# EAGLE schematic EBot4_v_12 (EAGLE 7.7.0)

## Sheet 1 of 4
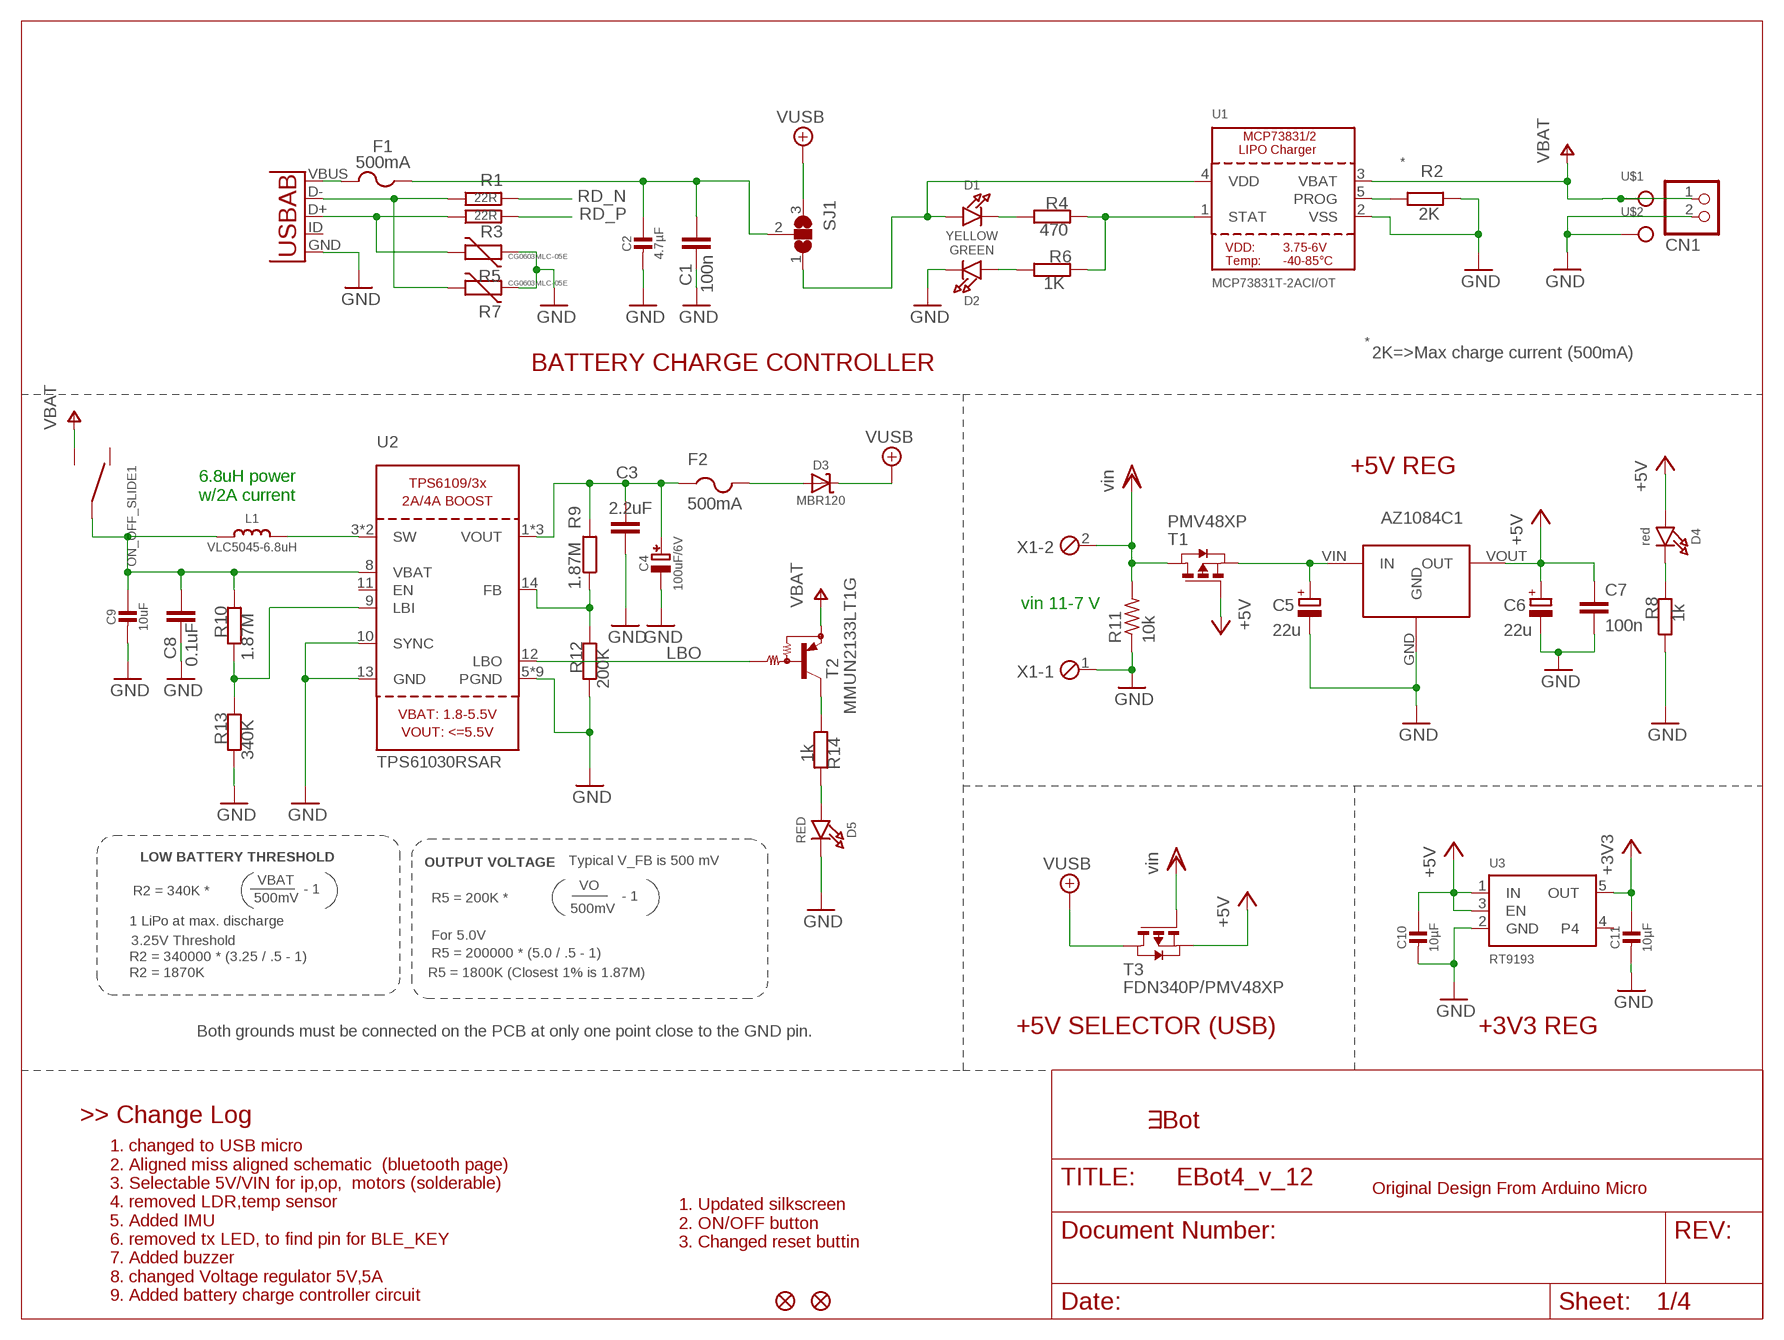
[diagram p0: schematic, sheet 1]

### Parts
AZ1084C1  AZ1084C  [AZ1084C]
C1  100n  C-EUC0402  [C0402]
C2  4.7µF  CAP_CERAMIC0805-NOOUTLINE  [0805-NO]
C3  2.2uF  C-EUC0402  [C0402]
C4  100uF/6V  CAP_TANTALUMB/3528_REFLOW  [EIA3528-21/B-R]
C5  22u  CPOL-EUSMCB  [SMC_B]
C6  22u  CPOL-EUSMCB  [SMC_B]
C7  100n  C-EUC0402  [C0402]
C8  0.1uF  C-EUC0402  [C0402]
C9  10uF  CAP_CERAMIC0805-NOOUTLINE  [0805-NO]
C10  10µF  CAP_CERAMIC_0805  [_0805]
C11  10µF  CAP_CERAMIC_0805  [_0805]
CN1  JST_2PIN-SMT  [JST-PH-2-SMT]
D1  YELLOW  LED0805_NOOUTLINE  [CHIPLED_0805_NOOUTLINE]
D2  GREEN  LED0805_NOOUTLINE  [CHIPLED_0805_NOOUTLINE]
D3  MBR120  DIODE-SCHOTTKYSOD-123  [SOD-123]
D4  red  LED0805_NOOUTLINE  [CHIPLED_0805_NOOUTLINE]
D5  RED  LED0805_NOOUTLINE  [CHIPLED_0805_NOOUTLINE]
EBOT_LOGO2  EBOT_NAME_6MM  [EBOT_NAME_6MM]
F1  500mA  PTCFUSE-1206  [R1206]
F2  500mA  PTCFUSE-1206  [R1206]
JP2  FIDUCIAL1X2  [FIDUCIAL-1X2]
JP3  FIDUCIAL1X2  [FIDUCIAL-1X2]
L1  VLC5045-6.8uH  INDUCTORTDK_VLC5045  [INDUCTOR_5X5MM_TDK_VLC5045]
ON_OFF_SLIDE1  OS102011MA1QN1  [OS102011MA1QN1]
R1  22R  R-EU_R0402  [R0402]
R2  2K  R-EU_R0402  [R0402]
R3  22R  R-EU_R0402  [R0402]
R4  470  R-EU_R0402  [R0402]
R5  CG0603MLC-05E  VARISTORCN0603  [CT/CN0603]
R6  1K  R-EU_R0402  [R0402]
R7  CG0603MLC-05E  VARISTORCN0603  [CT/CN0603]
R8  1k  R-EU_R0402  [R0402]
R9  1.87M  R-EU_R0402  [R0402]
R10  1.87M  R-EU_R0402  [R0402]
R11  10k  R-US_R0805  [R0805]
R12  200K  R-EU_R0402  [R0402]
R13  340K  R-EU_R0402  [R0402]
R14  1k  R-EU_R0402  [R0402]
SJ1  SJ2W  [SJ_2]
T1  PMV48XP  PMOSSOT23  [SOT-23]
T2  MMUN2133LT1G  MUN2114T1-PNP_DRIVER-SC59-BEC  [SC59-BEC]
T3  FDN340P/PMV48XP  PMOSSOT23  [SOT-23]
U1  MCP73831T-2ACI/OT  MCP73831/2  [SOT23-5]
U2  TPS61030RSAR  VREG_TPS6103X  [PVQFN-16]
U3  RT9193  VREG_SOT23-5  [SOT23-5@1]
U4  USB-AB  [USB-AB-MICRO-SMD]
U$1  BATCON  [BATCON]
U$2  BATCON  [BATCON]
X1  MPT2  [2POL254]

### Nets
+3V3: C11.1 U3.5(OUT) ; also sheet 3,4
+5V: AZ1084C1.VOUT(OUT) C6.+ C7.1 C10.1 D4.A T1.3(G) T3.2(S) U3.1(IN) U3.3(EN) ; also sheet 2,3,4
D+: R3.1 R5.1 U4.D+
D-: R1.1 R7.1 U4.D-
GND: AZ1084C1.GND C1.2 C2.2 C3.2 C4.- C5.- C6.- C7.2 C8.2 C9.2 C10.2 C11.2 CN1.2 D2.C D5.C R2.2 R5.2 R7.2 R8.1 R11.1 R12.1 R13.1 U1.2(VSS) U2.5(PGND) U2.6(PGND) U2.7(PGND) U2.10(SYNC) U2.13(GND) U2.P$18(PGND) U2.P$19(PGND) U2.P$20(PGND) U2.P$21(PGND) U2.P$22(PGND) U2.THERMAL(PGND) U3.2(GND) U4.GND U$2.P$1 X1.1 ; also sheet 2,3,4
LBI: R10.1 R13.2 U2.9(LBI)
LBO: T2.B U2.12(LBO)
N$1: D1.A SJ1.1 U1.4(VDD)
N$3: C8.1 C9.1 L1.P$1 ON_OFF_SLIDE1.P$2 R10.2 U2.8(VBAT)
N$7: D1.C R4.1
N$15: R4.2 R6.2 U1.1(STAT)
N$16: R2.1 U1.5(PROG)
N$17: D2.A R6.1
N$18: L1.P$2 U2.3(SW) U2.4(SW)
N$19: D4.C R8.2
N$20: D5.A R14.2
N$21: R14.1 T2.C
N$22: D3.A F2.2
N$26: F1.2 U4.VBUS
N$27: C1.1 C2.1 F1.1 SJ1.2
N$28: R9.1 R12.2 U2.14(FB)
N$30: AZ1084C1.VIN(IN) C5.+ T1.2(S)
RD_N: R1.2 ; also sheet 2
RD_P: R3.2 ; also sheet 2
V+: CN1.1 ON_OFF_SLIDE1.P$3 U1.3(VBAT) U$1.P$1 ; supply symbol labelled VBAT
VBAT: T2.E
VDD: R11.2 T1.1(D) T3.3(G) X1.2 ; supply symbol labelled vin ; also sheet 3
VOUT1: C3.1 C4.+ F2.1 R9.2 U2.1(VOUT) U2.15(VOUT) U2.16(VOUT)
VUSB: D3.C SJ1.3 T3.1(D) ; also sheet 2,4
Unconnected: ON_OFF_SLIDE1.P$1 U2.11(EN) U3.4 U4.ID(USBID)

### Notes on the sheet
- *
- *
- 2K=>Max charge current (500mA)
- BATTERY CHARGE CONTROLLER
- +5V REG
- 6.8uH power
  w/2A current
- vin 11-7 V
- LOW BATTERY THRESHOLD | Typical V_FB is 500 mV
- OUTPUT VOLTAGE
- VBAT
- - 1 | VO
- R2 = 340K *
- 500mV | R5 = 200K * | - 1
- 500mV
- 1 LiPo at max. discharge
- For 5.0V
- 3.25V Threshold
- R2 = 340000 * (3.25 / .5 - 1) | R5 = 200000 * (5.0 / .5 - 1)
- R2 = 1870K | R5 = 1800K (Closest 1% is 1.87M)
- Both grounds must be connected on the PCB at only one point close to the GND pin. | +5V SELECTOR (USB) | +3V3 REG
- >> Change Log
- Original Design From Arduino Micro
- 1. Updated silkscreen
  2. ON/OFF button
  3. Changed reset buttin
- 1. changed to USB micro
  2. Aligned miss aligned schematic  (bluetooth page)
  3. Selectable 5V/VIN for ip,op,  motors (solderable)
  4. removed LDR,temp sensor
  5. Added IMU
  6. removed tx LED, to find pin for BLE_KEY
  7. Added buzzer
  8. changed Voltage regulator 5V,5A
  9. Added battery charge controller circuit

## Sheet 2 of 4
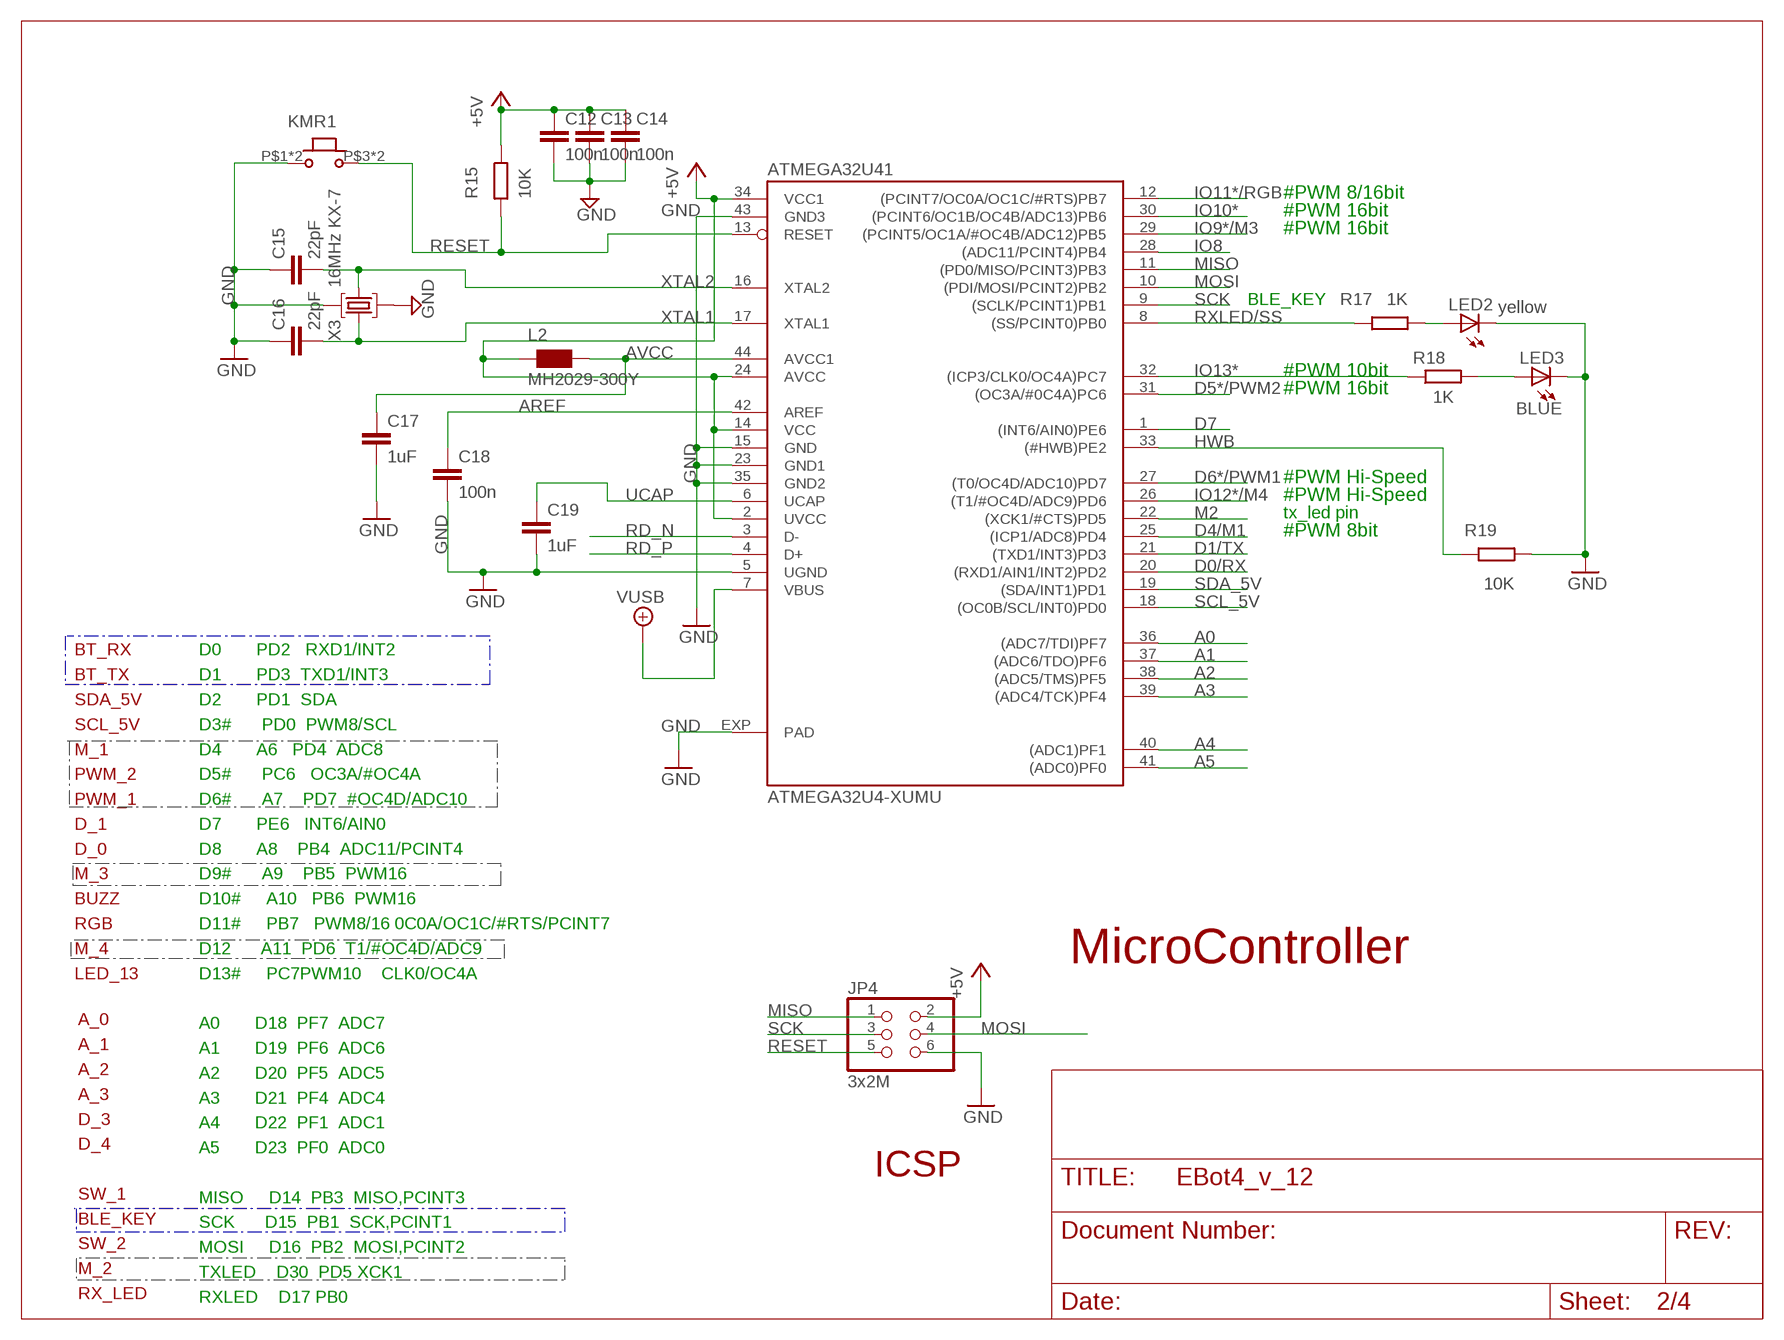
[diagram p1: schematic, sheet 2]

### Parts
ATMEGA32U41  ATMEGA32U4-XUMU  [QFN44ML7X7]
C12  100n  C-EUC0402  [C0402]
C13  100n  C-EUC0402  [C0402]
C14  100n  C-EUC0402  [C0402]
C15  22pF  C-EUC0402  [C0402]
C16  22pF  C-EUC0402  [C0402]
C17  1uF  C-EUC0402  [C0402]
C18  100n  C-EUC0402  [C0402]
C19  1uF  C-EUC0402  [C0402]
JP4  3x2M  PINHD-2X3  [2X03]
KMR1  KMR7  [KMR7]
L2  MH2029-300Y  WE-CBF_0805  [0805]
LED2  yellow  LEDCHIPLED_0805  [CHIPLED_0805]
LED3  BLUE  LEDCHIPLED_0805  [CHIPLED_0805]
R15  10K  R-EU_R0402  [R0402]
R17  1K  R-EU_R0402  [R0402]
R18  1K  R-EU_R0402  [R0402]
R19  10K  R-EU_R0402  [R0402]
X3  16MHz KX-7  CRYSTAL-3.2-2.5  [CRYSTAL-3.2-2.5]

### Nets
+5V: ATMEGA32U41.2(UVCC) ATMEGA32U41.14(VCC) ATMEGA32U41.24(AVCC) ATMEGA32U41.34(VCC1) C12.1 C13.1 C14.1 JP4.2 L2.1 R15.1 ; also sheet 1,3,4
A0: ATMEGA32U41.36((ADC7/TDI)PF7) ; also sheet 3
A1: ATMEGA32U41.37((ADC6/TDO)PF6) ; also sheet 3
A2: ATMEGA32U41.38((ADC5/TMS)PF5) ; also sheet 3
A3: ATMEGA32U41.39((ADC4/TCK)PF4) ; also sheet 3
A4: ATMEGA32U41.40((ADC1)PF1) ; also sheet 3
A5: ATMEGA32U41.41((ADC0)PF0) ; also sheet 3
AREF: ATMEGA32U41.42(AREF) C18.1
AVCC: ATMEGA32U41.44(AVCC1) C17.1 L2.2
D0/RX: ATMEGA32U41.20((RXD1/AIN1/INT2)PD2) ; also sheet 4
D1/TX: ATMEGA32U41.21((TXD1/INT3)PD3) ; also sheet 4
D4/M1: ATMEGA32U41.25((ICP1/ADC8)PD4) ; also sheet 3
D5*/PWM2: ATMEGA32U41.31((OC3A/#0C4A)PC6) ; also sheet 3
D6*/PWM1: ATMEGA32U41.27((T0/OC4D/ADC10)PD7) ; also sheet 3
D7: ATMEGA32U41.1((INT6/AIN0)PE6) ; also sheet 3
GND: ATMEGA32U41.5(UGND) ATMEGA32U41.15(GND) ATMEGA32U41.23(GND1) ATMEGA32U41.35(GND2) ATMEGA32U41.43(GND3) ATMEGA32U41.EXP(PAD) C12.2 C13.2 C14.2 C15.1 C16.1 C17.2 C18.2 C19.2 JP4.6 KMR1.P$1 KMR1.P$2 LED2.C LED3.C R19.2 X3.2(GND) X3.4(GND) ; also sheet 1,3,4
HWB: ATMEGA32U41.33((#HWB)PE2) R19.1
IO8: ATMEGA32U41.28((ADC11/PCINT4)PB4) ; also sheet 3
IO9*/M3: ATMEGA32U41.29((PCINT5/OC1A/#OC4B/ADC12)PB5) ; also sheet 3
IO10*: ATMEGA32U41.30((PCINT6/OC1B/OC4B/ADC13)PB6) ; also sheet 3
IO11*/RGB: ATMEGA32U41.12((PCINT7/OC0A/OC1C/#RTS)PB7) ; also sheet 3
IO12*/M4: ATMEGA32U41.26((T1/#OC4D/ADC9)PD6) ; also sheet 3
IO13*: ATMEGA32U41.32((ICP3/CLK0/OC4A)PC7) R18.1
M2: ATMEGA32U41.22((XCK1/#CTS)PD5) ; also sheet 3
MISO: ATMEGA32U41.11((PD0/MISO/PCINT3)PB3) JP4.1 ; also sheet 4
MOSI: ATMEGA32U41.10((PDI/MOSI/PCINT2)PB2) JP4.4 ; also sheet 4
N$2: LED2.A R17.2
N$4: LED3.A R18.2
RD_N: ATMEGA32U41.3(D-) ; also sheet 1
RD_P: ATMEGA32U41.4(D+) ; also sheet 1
RESET: ATMEGA32U41.13(RESET) JP4.5 KMR1.P$3 KMR1.P$4 R15.2
RXLED/SS: ATMEGA32U41.8((SS/PCINT0)PB0) R17.1
SCK: ATMEGA32U41.9((SCLK/PCINT1)PB1) JP4.3 ; also sheet 4
SCL_5V: ATMEGA32U41.18((OC0B/SCL/INT0)PD0) ; also sheet 3
SDA_5V: ATMEGA32U41.19((SDA/INT1)PD1) ; also sheet 3
UCAP: ATMEGA32U41.6(UCAP) C19.1
VUSB: ATMEGA32U41.7(VBUS) ; also sheet 1,4
XTAL1: ATMEGA32U41.17(XTAL1) C16.2 X3.3(C2)
XTAL2: ATMEGA32U41.16(XTAL2) C15.2 X3.1(C1)

### Buses
B$1
B$2

### Notes on the sheet
- #PWM 8/16bit
- #PWM 16bit
- #PWM 16bit
- BLE_KEY
- #PWM 10bit
- #PWM 16bit
- #PWM Hi-Speed
- #PWM Hi-Speed
- tx_led pin
- #PWM 8bit
- BT_RX
  BT_TX
  SDA_5V
  SCL_5V
  M_1
  PWM_2
  PWM_1
  D_1
  D_0
  M_3
  BUZZ
  RGB
  M_4
  LED_13
- D0       PD2   RXD1/INT2 
  D1       PD3  TXD1/INT3
  D2       PD1  SDA
  D3#      PD0  PWM8/SCL
  D4       A6   PD4  ADC8
  D5#      PC6   OC3A/#OC4A
  D6#      A7    PD7  #OC4D/ADC10
  D7       PE6   INT6/AIN0
  D8       A8    PB4  ADC11/PCINT4
  D9#      A9    PB5  PWM16
  D10#     A10   PB6  PWM16
  D11#     PB7   PWM8/16 0C0A/OC1C/#RTS/PCINT7
  D12      A11  PD6  T1/#OC4D/ADC9
  D13#     PC7PWM10    CLK0/OC4A 
  
  A0       D18  PF7  ADC7
  A1       D19  PF6  ADC6
  A2       D20  PF5  ADC5
  A3       D21  PF4  ADC4
  A4       D22  PF1  ADC1
  A5       D23  PF0  ADC0
  
  MISO     D14  PB3  MISO,PCINT3
  SCK      D15  PB1  SCK,PCINT1
  MOSI     D16  PB2  MOSI,PCINT2
  TXLED    D30  PD5 XCK1
  RXLED    D17 PB0
- MicroController
- A_0
  A_1
  A_2
  A_3
  D_3
  D_4
   
  SW_1
  BLE_KEY
  SW_2
  M_2
  RX_LED
- ICSP

## Sheet 3 of 4
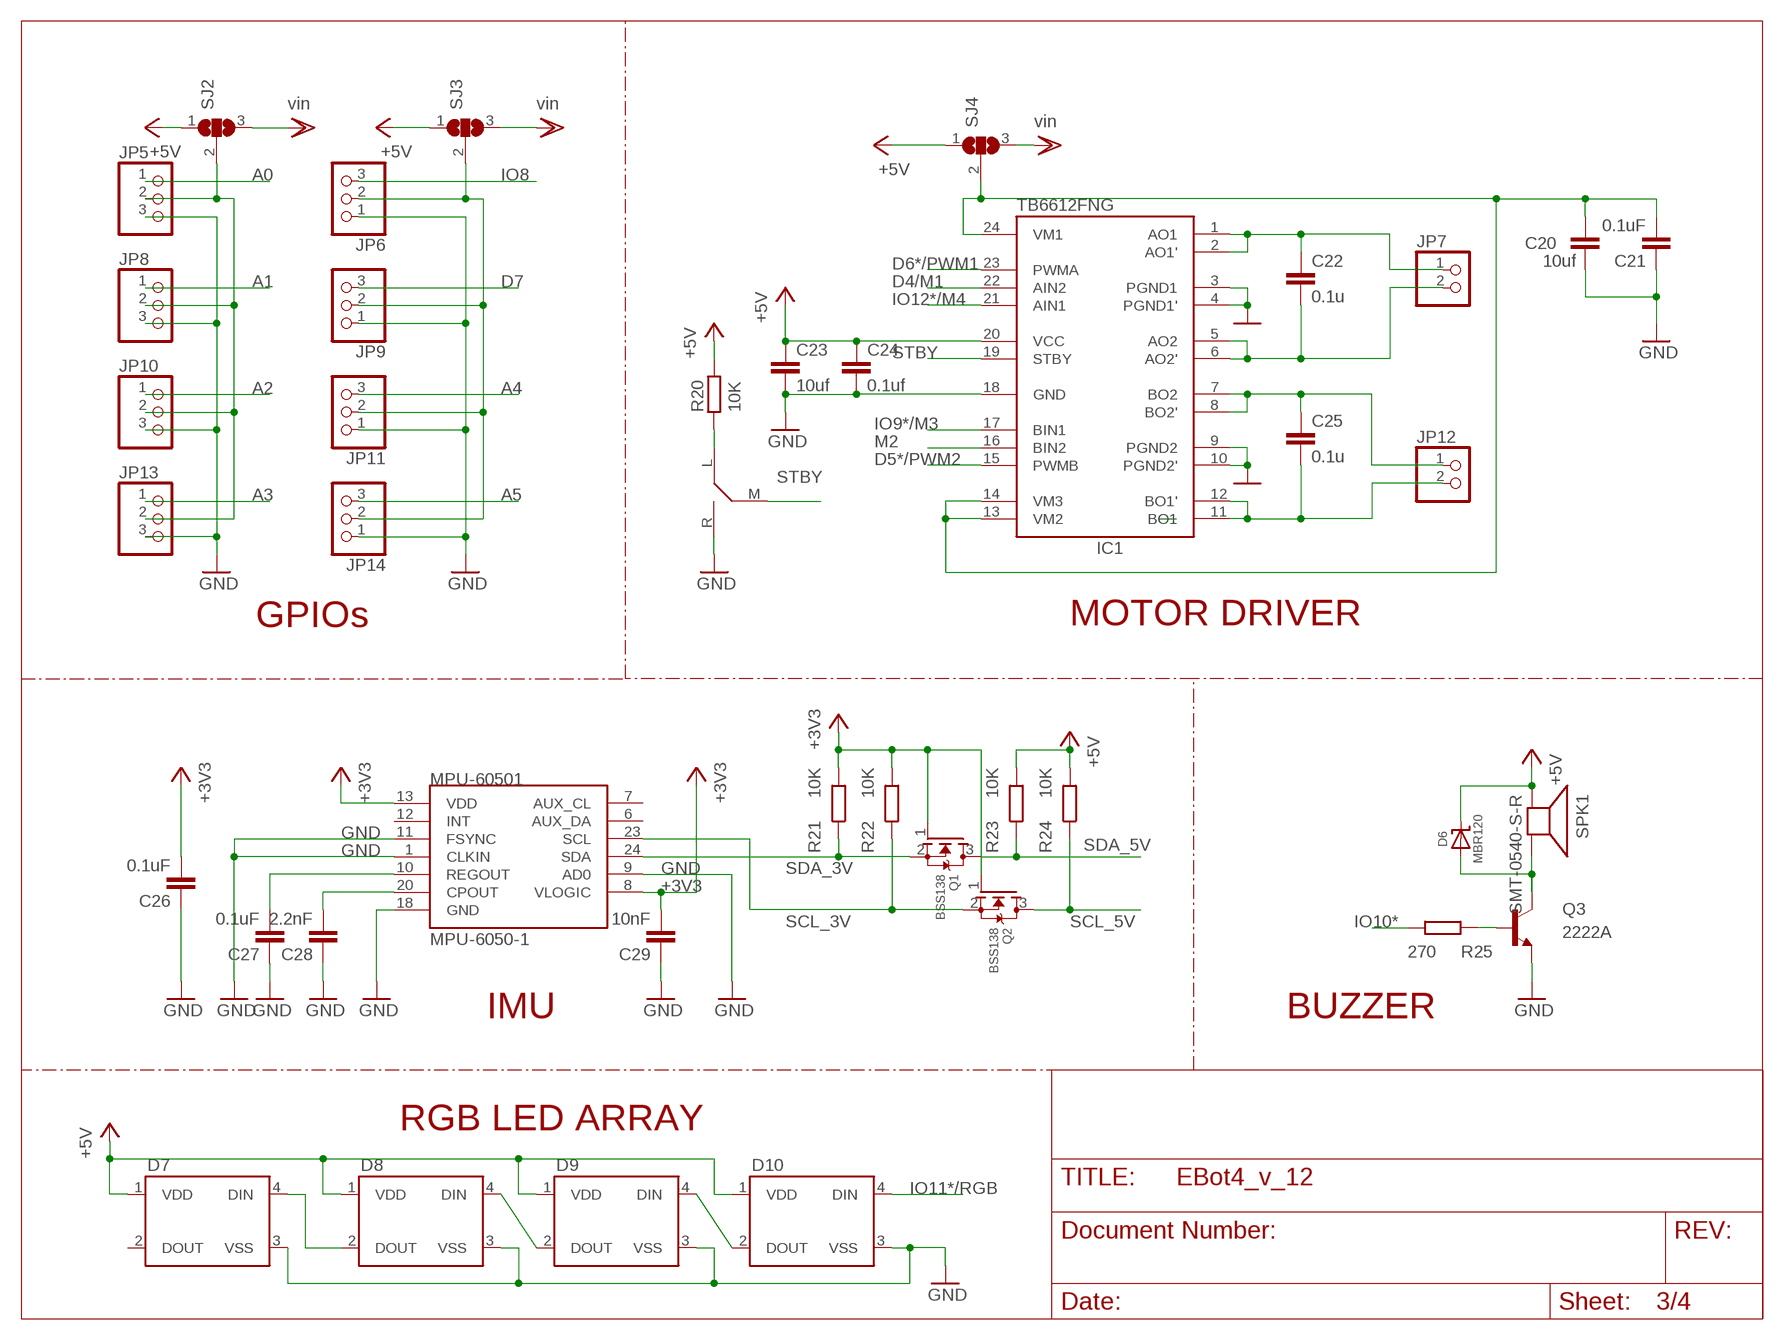
[diagram p2: schematic, sheet 3]

### Parts
C20  10uf  CAPACITOR-0.1UF/6.3V  [C0603]
C21  0.1uF  C-EUC0402  [C0402]
C22  0.1u  CAPACITOR-0.1UF/6.3V  [C0603]
C23  10uf  CAPACITOR-0.1UF/6.3V  [C0603]
C24  0.1uf  CAPACITOR-0.1UF/6.3V  [C0603]
C25  0.1u  CAPACITOR-0.1UF/6.3V  [C0603]
C26  0.1uF  C-EUC0402  [C0402]
C27  0.1uF  C-EUC0402  [C0402]
C28  2.2nF  C-EUC0402  [C0402]
C29  10nF  C-EUC0402  [C0402]
D6  MBR120  DIODE-SCHOTTKYSOD-123  [SOD-123]
D7  WS2812B  [WS2812B]
D8  WS2812B  [WS2812B]
D9  WS2812B  [WS2812B]
D10  WS2812B  [WS2812B]
IC1  TB6612FNG  [SSOP24]
JP5  PINHD-1X03_2.54-SMD-90°  [1X03SMD/90]
JP6  PINHD-1X03_2.54-SMD-90°  [1X03SMD/90]
JP7  PINHD-1X02_2.54-SMD-90°  [1X02SMD/90]
JP8  PINHD-1X03_2.54-SMD-90°  [1X03SMD/90]
JP9  PINHD-1X03_2.54-SMD-90°  [1X03SMD/90]
JP10  PINHD-1X03_2.54-SMD-90°  [1X03SMD/90]
JP11  PINHD-1X03_2.54-SMD-90°  [1X03SMD/90]
JP12  PINHD-1X02_2.54-SMD-90°  [1X02SMD/90]
JP13  PINHD-1X03_2.54-SMD-90°  [1X03SMD/90]
JP14  PINHD-1X03_2.54-SMD-90°  [1X03SMD/90]
MPU-60501  MPU-6050-1  [QFN-24-4MM2]
Q1  BSS138  MOSFET-NWIDE  [SOT23-WIDE@1]
Q2  BSS138  MOSFET-NWIDE  [SOT23-WIDE@1]
Q3  2222A  TRANSISTOR_NPNMMBT2222A  [SOT23-3]
R20  10K  RESISTOR-10K_1/8W  [R0603]
R21  10K  R-EU_R0402  [R0402]
R22  10K  R-EU_R0402  [R0402]
R23  10K  R-EU_R0402  [R0402]
R24  10K  R-EU_R0402  [R0402]
R25  270  R-EU_R0402  [R0402]
SJ2  SJ2W  [SJ_2]
SJ3  SJ2W  [SJ_2]
SJ4  SJ2W  [SJ_2]
SK-12C04051  SK-12C0405  [SK-12C0405]
SPK1  SMT-0540-S-R  [SMT-0540-S-R]

### Nets
+3V3: C26.2 C29.2 MPU-60501.8(VLOGIC) MPU-60501.13(VDD) Q1.1(G) Q2.1(G) R21.2 R22.2 ; also sheet 1,4
+5V: C23.1 C24.1 D6.C D7.1(VDD) D8.1(VDD) D9.1(VDD) D10.1(VDD) IC1.20(VCC) R20.2 R23.2 R24.2 SJ2.1 SJ3.1 SJ4.1 SPK1.-(+) ; also sheet 1,2,4
A0: JP5.1 ; also sheet 2
A1: JP8.1 ; also sheet 2
A2: JP10.1 ; also sheet 2
A3: JP13.1 ; also sheet 2
A4: JP11.3 ; also sheet 2
A5: JP14.3 ; also sheet 2
AO1': C22.1 IC1.1(AO1) IC1.2(AO1') JP7.1
AO2': C22.2 IC1.5(AO2) IC1.6(AO2') JP7.2
BO1': C25.2 IC1.11(BO1) IC1.12(BO1') JP12.2
BO2': C25.1 IC1.7(BO2) IC1.8(BO2') JP12.1
D4/M1: IC1.22(AIN2) ; also sheet 2
D5*/PWM2: IC1.15(PWMB) ; also sheet 2
D6*/PWM1: IC1.23(PWMA) ; also sheet 2
D7: JP9.3 ; also sheet 2
GND: C20.2 C21.1 C23.2 C24.2 C26.1 C27.1 C28.1 C29.1 D7.3(VSS) D8.3(VSS) D9.3(VSS) D10.3(VSS) IC1.3(PGND1) IC1.4(PGND1') IC1.9(PGND2) IC1.10(PGND2') IC1.18(GND) JP5.3 JP6.1 JP8.3 JP9.1 JP10.3 JP11.1 JP13.3 JP14.1 MPU-60501.1(CLKIN) MPU-60501.9(AD0) MPU-60501.11(FSYNC) MPU-60501.18(GND) Q3.2(E) SK-12C04051.R(RIGHT) ; also sheet 1,2,4
IO8: JP6.3 ; also sheet 2
IO9*/M3: IC1.17(BIN1) ; also sheet 2
IO10*: R25.2 ; also sheet 2
IO11*/RGB: D10.4(DIN) ; also sheet 2
IO12*/M4: IC1.21(AIN1) ; also sheet 2
M2: IC1.16(BIN2) ; also sheet 2
N$5: D9.4(DIN) D10.2(DOUT)
N$8: D8.4(DIN) D9.2(DOUT)
N$10: JP5.2 JP8.2 JP10.2 JP13.2 SJ2.2
N$11: C28.2 MPU-60501.20(CPOUT)
N$12: C27.2 MPU-60501.10(REGOUT)
N$13: D7.4(DIN) D8.2(DOUT)
N$23: JP6.2 JP9.2 JP11.2 JP14.2 SJ3.2
N$24: Q3.1(B) R25.1
N$29: D6.A Q3.3(C) SPK1.+(-)
N$31: C20.1 C21.2 IC1.13(VM2) IC1.14(VM3) IC1.24(VM1) SJ4.2
N$43: R20.1 SK-12C04051.L(LEFT)
SCL_3V: MPU-60501.23(SCL) Q2.2(S) R22.1
SCL_5V: Q2.3(D) R24.1 ; also sheet 2
SDA_3V: MPU-60501.24(SDA) Q1.2(S) R21.1
SDA_5V: Q1.3(D) R23.1 ; also sheet 2
STBY: IC1.19(STBY) SK-12C04051.M(MID)
VDD: SJ2.3 SJ3.3 SJ4.3 ; supply symbol labelled vin ; also sheet 1
Unconnected: D7.2(DOUT) MPU-60501.6(AUX_DA) MPU-60501.7(AUX_CL) MPU-60501.12(INT)

### Notes on the sheet
- GPIOs | MOTOR DRIVER
- IMU | BUZZER
- RGB LED ARRAY

## Sheet 4 of 4
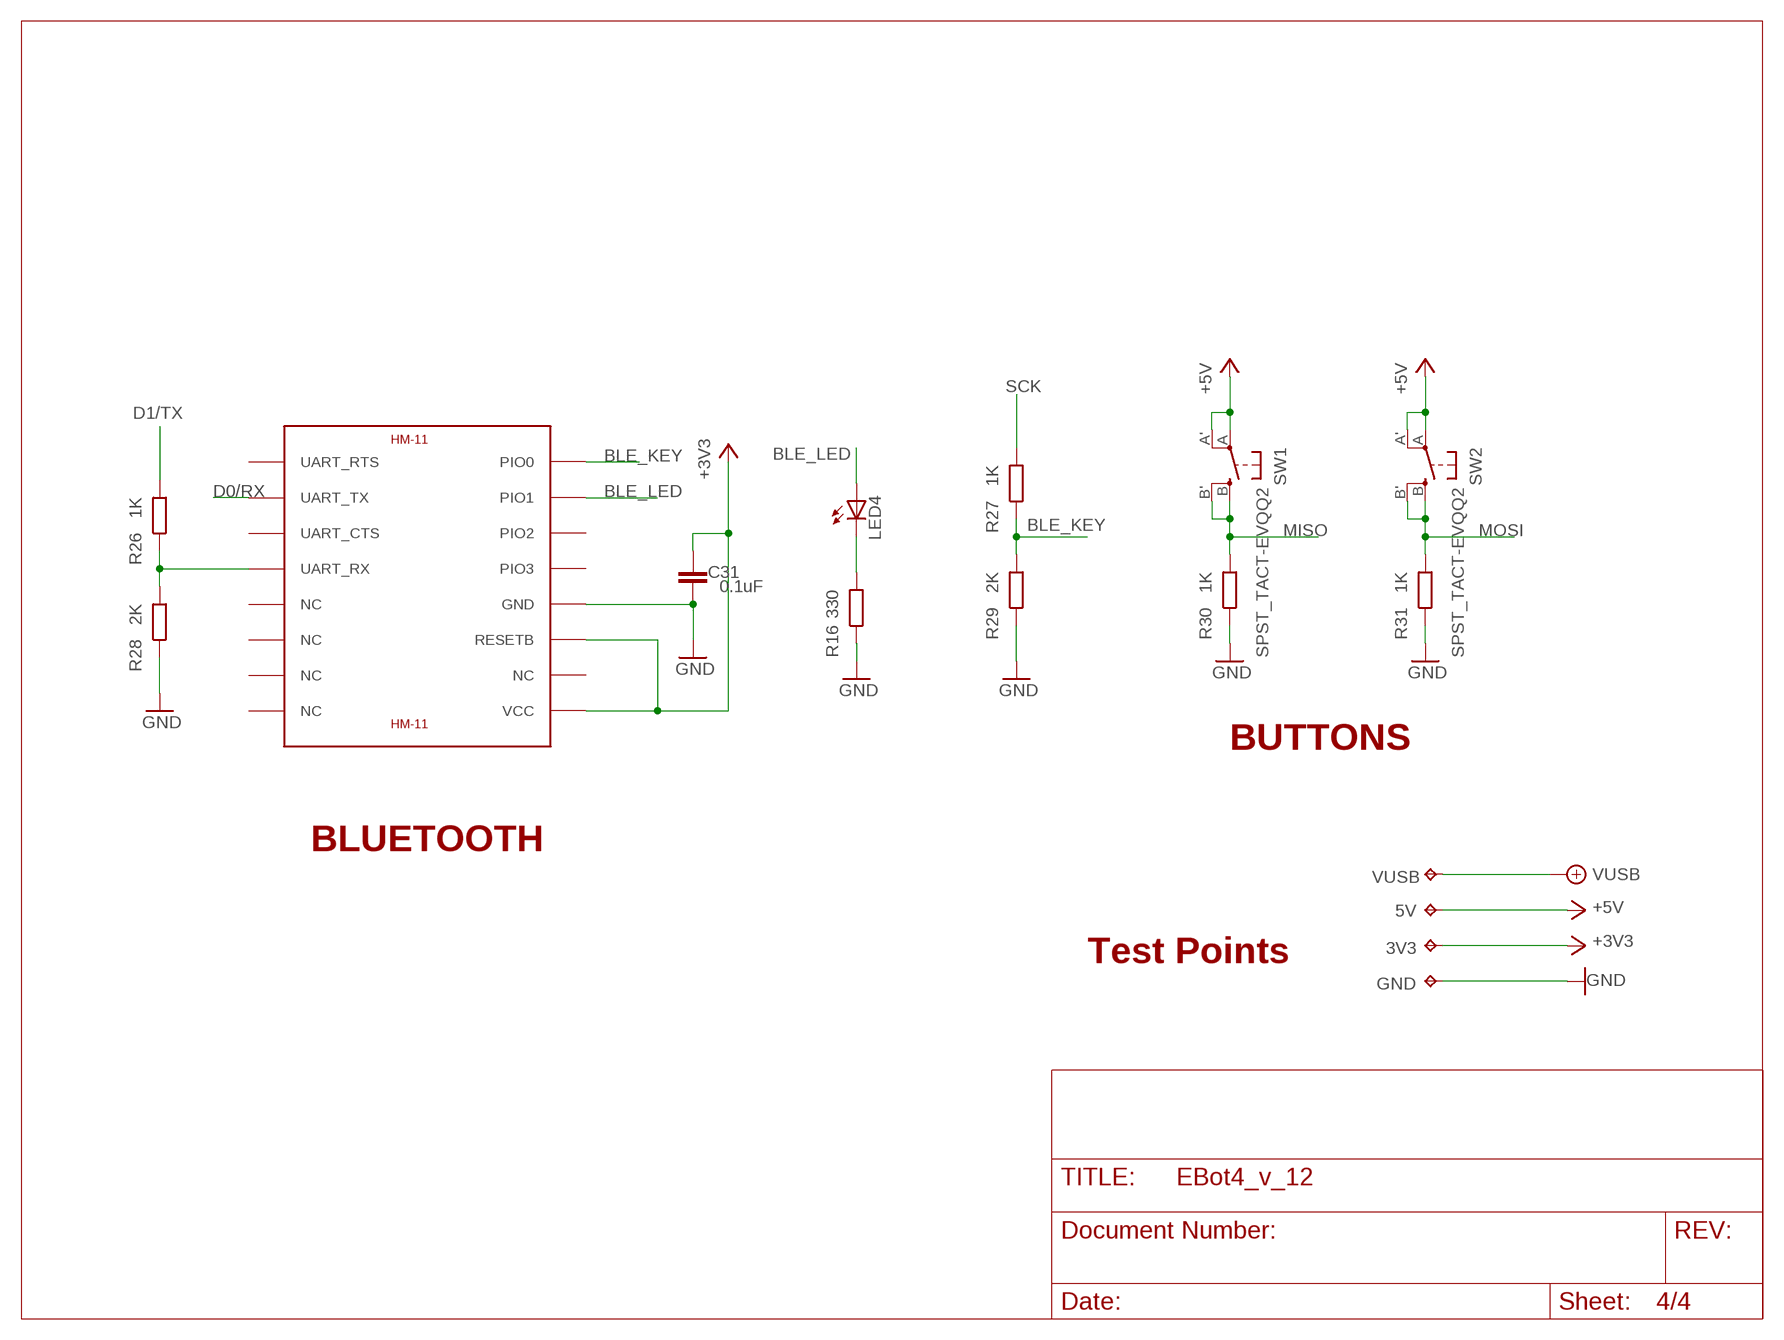
[diagram p3: schematic, sheet 4]

### Parts
3V3  TPB1,27  [B1,27]
5V  TPB1,27  [B1,27]
C31  0.1uF  CAP0805  [0805]
GND  TPB1,27  [B1,27]
HM-111  HM-11  [HM-11]
LED4  LEDCHIP-LED0805  [CHIP-LED0805]
R16  330  R-EU_R0402  [R0402]
R26  1K  R-EU_R0402  [R0402]
R27  1K  R-EU_R0402  [R0402]
R28  2K  R-EU_R0402  [R0402]
R29  2K  R-EU_R0402  [R0402]
R30  1K  R-EU_R0402  [R0402]
R31  1K  R-EU_R0402  [R0402]
SW1  SPST_TACT-EVQQ2  [EVQ-Q2]
SW2  SPST_TACT-EVQQ2  [EVQ-Q2]
VUSB  TPB1,27  [B1,27]

### Nets
+3V3: 3V3.TP C31.2 HM-111.RESETB HM-111.VCC ; also sheet 1,3
+5V: 5V.TP SW1.A'(P1) SW1.A(P) SW2.A'(P1) SW2.A(P) ; also sheet 1,2,3
BLE_KEY: HM-111.PIO0 R27.1 R29.2
BLE_LED: HM-111.PIO1 LED4.A
D0/RX: HM-111.UART_TX ; also sheet 2
D1/TX: R26.2 ; also sheet 2
GND: C31.1 GND.TP HM-111.GND R16.1 R28.1 R29.1 R30.1 R31.1 ; also sheet 1,2,3
MISO: R30.2 SW1.B'(S1) SW1.B(S) ; also sheet 2
MOSI: R31.2 SW2.B'(S1) SW2.B(S) ; also sheet 2
N$9: HM-111.UART_RX R26.1 R28.2
N$14: LED4.C R16.2
SCK: R27.2 ; also sheet 2
VUSB: VUSB.TP ; also sheet 1,2
Unconnected: HM-111.NC@5(NC) HM-111.NC@6(NC) HM-111.NC@7(NC) HM-111.NC@8(NC) HM-111.NC@10(NC) HM-111.PIO2 HM-111.PIO3 HM-111.UART_CTS HM-111.UART_RTS

### Notes on the sheet
- BUTTONS
- BLUETOOTH
- Test Points

## Library data of the parts
3V3 5V GND VUSB = testpad:TP: Test pad
ATMEGA32U41 = SmartPrj:ATMEGA32U4-XU
AZ1084C1 = AZ1084C:AZ1084C
C1 C3 C7 C8 C12-C19 C21 C26-C29 = SmartPrj:C-EU: CAPACITOR, European symbol
C2 C9-C11 = microbuilder:CAP_CERAMIC: Ceramic Capacitors For new designs, use the packages preceded by an '_' character since they are more reliable: The following footprints should be used on most boards: _0402 - Standard footprint for regular board layouts _0603 - Standard footprint for regular board layouts _0805 - Standard footprint for regular board layouts _1206 - Standard footprint for regular board layouts For extremely tight-pitch boards where space is at a premium, the following 'micro-pitch' footprints can be used (smaller pads, no silkscreen outline, etc.): _0402MP - Micro-pitch footprint for very dense/compact boards _0603MP - Micro-pitch footprint for very dense/compact boards _0805MP - Micro-pitch footprint for very dense/compact boards _1206MP - Micro-pitch footprint for very dense/compact boards
C4 = microbuilder:CAP_TANTALUM: Tantalum Capacitors Wave footprints have larger pads and are meant to be used for hand soldering. Reflow footprints are optimised for solder paste and a reflow oven. EIA3216-18/A-[R/W] - Size A / 3216-18 / 1206 footprint 4.7µF 25V 10% Tantalum Capacitor 10µF 16V 10% Tantalum Capacitor [Digikey: 495-2236-2-ND] EIA3528-21/B-[R/W] - Size B / 3528-21 47µF 10V 10% Tantalum Capactior [Digikey: 495-2216-1-ND] EIA6032-28/C-[R/W] - Size C / 6032-28 10µF 35V 20% Tantalum Capacitor [Digikey: 495-2285-1-ND] 100µF 16V 10% Tantalum Capactior [Digikey: 399-5214-1-ND]
C5 C6 = rcl:CPOL-EU: POLARIZED CAPACITOR, European symbol
C20 C22-C25 = BaseApp:CAPACITOR: CAPACITOR; DIGIKEY: 490-9730-1-ND; PRICE_PER_UNIT: 0.1
C31 = SparkFun:CAP: Capacitor Standard 0603 ceramic capacitor, and 0.1" leaded capacitor.
CN1 = adafruit:JST_2PIN: JST 2-Pin Connectors of various flavors SMT-RA (S2B-PH-SM4) 4UConnector #17311 SMT (B2B-PH-SM4) THM-RA (S2B-PH) THM (B2B-PH)
D1 D2 D4 D5 = microbuilder:LED: LED
D3 D6 = microbuilder:DIODE-SCHOTTKY
D7-D10 = WS2812BSparkFun-LED:WS2812B: WS2812B - Intelligent control LED integrated light source Technical Specifications: Power Supply Voltage (VDD): 3.5 to 5.3 V Input Voltage (VI): -0.5 to VDD+0.5 V Operating Junction Temperature (Topt): -25°C to +80°C Storage Temperature Range (Tstg): -55°C to +150°C; PROD_ID: DIO-12503
EBOT_LOGO2 = EbotLogos:EBOT_NAME_6MM
F1 F2 = adafruit:PTCFUSE: PTC fuses, resettable thermistors
HM-111 = hm-11:HM-11: JNHuaMao HM-11 Bluetooth 4.0 Transceiver based on TI CC2540/CC2541
IC1 = adafruit:TB6612FNG: TB6612FNG MOS dual H-bridge motor driver, 1.2A current 3.2A peak 3 or 5v logic and 3-15v motor
JP2 JP3 = SparkFun:FIDUCIAL: Fiducial Alignment Points Various fiducial points for machine vision alignment.
JP4 = SmartPrj:PINHD-2X3: PIN HEADER
JP5 JP6 JP8-JP11 JP13 JP14 = pinhead-2:PINHD-1X03: PIN HEADER
JP7 JP12 = pinhead-2:PINHD-1X02: PIN HEADER
KMR1 = KMR7-SWITCH_2:KMR7
L1 = microbuilder:INDUCTOR: Inductors 0603: 10nH Ceramic Inductor - microwire antenna/RF (Digikey: 712-1434-2-ND) 0805: 560nH Ceramic Inductor - RF (Digikey: 553-1047-1-ND) 270nH Ceramic Inductor - Q = 40@250MHz, +-5%, 1 Ohm DC Resistance (Digikey: 535-10506-2-ND) 1007 (2518 Metric) SMT: 10µH 10% 250mOhm 820mA 1007 Inductor (Digikey: 587-2189-1-ND) 22µH 10% 500mOhm 580mA 1007 Inductor (Digikey: 587-2190-1-ND) 47µH 10% 950mOhm 420mA 1007 Inductor (Digikey: 587-2191-1-ND) 47µH 5% 100mOhm 1A 1008 Inductor (Digikey: 732-1816-1-ND) 5.0x5.0mm (Taiyo Yuden NR5040 Series) 6.8µH 20% 2.3A 64mOhm Inductor (Digikey: 587-2374-2-ND) 5.0x5.0mm (TDK VLC5045 Series) 4.7µH 20% 3.3A 34mOhm Inductor (Digikey: 445-6526-1-ND) 6.8µH 20% 2.7A 46mOhm Inductor (Digikey: 445-6527-1-ND) 6.0x6.0mm (TDK VLC6045 Series) 4.7µH 20% 3.8A 27mOhm Inductor (Digikey: 445-6538-2-ND) 6.8µH 20% 3A 41mOhm Inductor (Digikey: 445-6540-1-ND) 6.2µH 30% 2.2A 45mOhm Inductor (Digikey: SRR5028-6R2YCT-ND) - Not TDK VLC6045 but footprint should match 6.0x6.0mm (TDK SLF6045 Series) 6.8uH 30% 2A 33mOhm Inductor (Digikey: 445-4572-1-ND, Mouser: 810-SLF645T6R8N2R0PF) 6.0x6.0mm (Sumida CDRH5D28 Series) 6.2uH 30% 1.8A 45mOhm Inductor (Digikey: 308-1542-1-ND) Taiyo Yuden NR3015T2R2M - 2.2uH 20% 1.5A (Digikey: 587-1648-2-ND, Mouser: 963-NR3015T2R2M) - Used with TI TPS62172 CoilCraft RFID Transponder Coil - MA5532-AE (For use with AS3935 Lightning Sensor) Vishay IHLP 1.0uH Molded Inductor - 24mOhm DCR, 5A, +/-20%, -55°C-125°C (Digikey: 541-1319-1-ND)
L2 = wuerth-elektronik:WE-CBF: SMD EMI Suppression Ferrite Beads - excellent anti-EMI properties - low DCR - impedances till 3000 ohms - rated current up to 6 A
LED2-LED4 = led:LED: LED
MPU-60501 = newTesting:MPU-6050
ON_OFF_SLIDE1 = ebot4OnOff:OS102011MA1QN1
Q1 Q2 = microbuilder:MOSFET-N: N-Channel Mosfet LEGEND VDS: Voltage Drain-Source ID: Drain Current RDS(ON): Drain-Source On-State Resistance VGS(TH): Gate-Source Threshold Voltage CISS: Drain-Source Input Capacitance SOT-23 Name VDS ID RDS(ON) VGS(TH) CISS Order Number 2N7002E 60V 260mA 2.5 Ohm 2.5V @ 250uA 26.7pF @ 25V 2N7002ET1GOSTR-ND BSH103 30V 850mA 400 mOhm 400mV @ 1mA 83pF @ 24V BSH103,235-ND BSS138 60V 320mA 1.6 Ohm 1.5V @ 250uA 50pF @ 10V Mouser: 771-BSS138PW115 DMN2075U-7 20V 4.2A 38 mOhm 1V @ 250 uA 594.3pF @ 10V DMN2075U-7DICT-ND * BSS138 good choice for I2C level-shifting
Q3 = SparkFun-DiscreteSemi:TRANSISTOR_NPN: Generic NPN BJT MMBT2222A - TRANS-08049 (SOT-23, 1A 40V) MPSA42 - TRANS-09116 (SOT-23, 500mA 300V) MMBT5088LT1G - TRANS-11160 (SOT-23, 50 mA 30V) BC547 - COM-08928 <http://www.sparkfun.com/products/8928> (TO-92 45V 100mA) (1.Collector 2.Base 3.Emitter) 2N3904 - COM-00521 <http://www.sparkfun.com/products/521> (TO-92 40V 200mA) (1.Emitter 2.Base 3.Collector) P2N2222A - COM-12852 <http://www.sparkfun.com/products/12852> (TO-92 40V 600mA) (1.Collector 2.Base 3.Emitter); PROD_ID: TRANS-08049; VALUE: MMBT2222A
R1-R4 R6 R8-R10 R12-R19 R21-R31 = SmartPrj:R-EU_: RESISTOR, European symbol
R5 R7 = varistor:VARISTOR: VARISTOR
R11 = resistor:R-US_: RESISTOR, American symbol
R20 = BaseApp:RESISTOR: Resistance Mount :-Surface mount; DIGIKEY: MCT0603-10.0K-CFCT-ND; PRICE_PER_UNIT: 0.08
SJ1-SJ4 = jumper:SJ2W: SMD solder JUMPER
SK-12C04051 = SK-12C0405:SK-12C0405
SPK1 = adafruit:SMT-0540-S-R: SMT-0549-S-R Small surface-mount magnetic buzzer
SW1 SW2 = adafruit:SPST_TACT: SMT 6mm switch, EVQQ2 series http://www.ladyada.net/library/eagle
T1 T3 = zetex:PMOSSOT23: MOS FET; OC_FARNELL: unknown; OC_NEWARK: unknown
T2 = transistor:*-PNP_DRIVER-: PNP Bias Resistor Transistor
U1 = microbuilder:MCP73831/2: MCP73831/2 LIPO Charger VDD: 3.75 - 6V Temp -40 - 85°C Programmable Charge Rate: 15-500mA NOTE: STAT is a tri-state logic output on the MCP73831 and an open-drain output on the MCP73832. SOT23-5 with 4.2V output and tri-state logic on STAT = MCP73831T-2ACI/OT
U2 = microbuilder:VREG_TPS6103X: TPS6103x 4A Boost - 1.8-5.5V Input, Adjustable Output to 5.5V
U3 = microbuilder:VREG_SOT23-5: SOT23-5 Fixed Voltage Regulators To better organise some of the SOT23-5 fixed voltage regulators in this library, this new part was created. Part Current Out V Out V In V Dropout Digikey Part No. ADP121 150mA 3.3V 3.4-5.5V 0.09V @ 150mA ADP121-AUJZ33R7CT-ND ADP121 150mA 3.0V 3.1-5.5V 0.09V @ 150mA ADP121-AUJZ30R7CT-ND ADP122 300mA 3.3V 3.4-5.5V 0.085V @ 300mA ADP122AUJZ-3.3-R7CT-ND ADP1712 300mA 3.3V 3.5-5.5V 0.17V @ 300mA ADP1712AUJZ-3.3-R7TR-ND AP7311 (Low Cost) 150mA 3.3V 3.5-6V 0.15V @ 150mA AP7311-33WG-7DICT-ND LD39015M18R 150mA 1.8V 1.9V-5.5V 0.08V @ 100mA 497-6977-1-ND MCP1824T-3302E/OT 300mA 3.3V 3.5V-6V 0.2V @ 300mA MCP1824T-3302E/OTCT-ND MIC5205-2.5YM5 TR 150mA 2.5V 2.7-16V 0.165V @ 150mA 576-1257-2-ND MIC5205-3.0YM5 TR 150mA 3.0V 3.2V-16V 0.165V @ 150mA 576-1258-2-ND MIC5205-3.3YM5 TR 150mA 3.3V 3.5V-16V 0.165V @ 150mA 576-1259-2-ND TPS780330220 150mA 3.3V+2.2V 3.6-5.5V 250mV Max 296-23332-1-ND TDA3663/N1,135 100mA 3.3V 3.5-45V 0.18V @ 50mA 568-5343-1-ND
U4 = Atmega32uDIPLABELED:USB-AB: This is a USB AB connector that is compatible with USB OTG. i.e. this connector can serve as a host or device
U$1 U$2 = BATCON:BATCON
X1 = con-phoenix-254:MPT2: PHOENIX CONNECTOR; OC_FARNELL: unknown; OC_NEWARK: unknown
X3 = SmartPrj:CRYSTAL-3.2-2.5